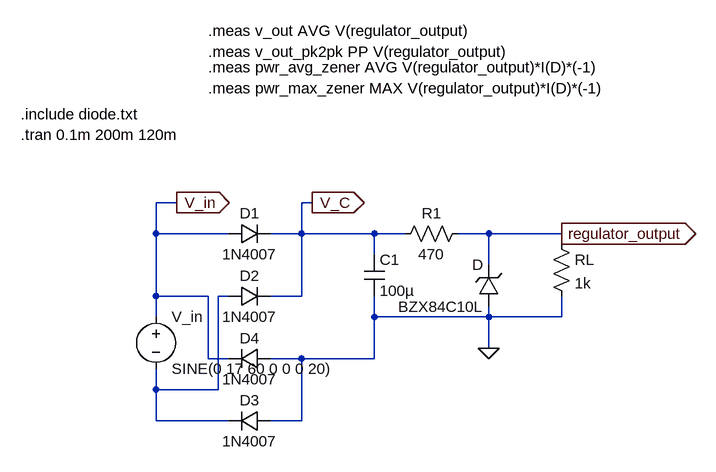
[diagram p0: schematic ECE2285_Project1.asc]
ECE2285_Project1.asc, the LTspice schematic file:
Version 4
SHEET 1 1112 680
WIRE 288 -80 256 -80
WIRE 496 -80 480 -80
WIRE 256 -32 256 -80
WIRE 368 -32 256 -32
WIRE 480 -32 480 -80
WIRE 480 -32 432 -32
WIRE 592 -32 480 -32
WIRE 640 -32 592 -32
WIRE 768 -32 720 -32
WIRE 880 -32 768 -32
WIRE 880 -16 880 -32
WIRE 592 0 592 -32
WIRE 768 16 768 -32
WIRE 256 64 256 -32
WIRE 336 64 256 64
WIRE 368 64 352 64
WIRE 480 64 480 -32
WIRE 480 64 432 64
WIRE 256 96 256 64
WIRE 592 96 592 64
WIRE 768 96 768 80
WIRE 768 96 592 96
WIRE 880 96 880 64
WIRE 880 96 768 96
WIRE 768 144 768 96
WIRE 336 160 336 64
WIRE 368 160 336 160
WIRE 480 160 432 160
WIRE 592 160 592 96
WIRE 592 160 480 160
WIRE 256 208 256 176
WIRE 352 208 352 64
WIRE 352 208 256 208
WIRE 256 256 256 208
WIRE 368 256 256 256
WIRE 480 256 480 160
WIRE 480 256 432 256
FLAG 768 144 0
FLAG 880 -32 regulator_output
IOPIN 880 -32 Out
FLAG 496 -80 V_C
IOPIN 496 -80 Out
FLAG 288 -80 V_in
IOPIN 288 -80 Out
SYMBOL voltage 256 80 R0
SYMATTR InstName V_in
SYMATTR Value SINE(0 17 60 0 0 0 20)
SYMBOL diode 368 -16 R270
WINDOW 0 32 32 VTop 2
WINDOW 3 0 32 VBottom 2
SYMATTR InstName D1
SYMATTR Value 1N4007
SYMBOL diode 368 80 R270
WINDOW 0 32 32 VTop 2
WINDOW 3 0 32 VBottom 2
SYMATTR InstName D2
SYMATTR Value 1N4007
SYMBOL diode 432 240 R90
WINDOW 0 0 32 VBottom 2
WINDOW 3 32 32 VTop 2
SYMATTR InstName D3
SYMATTR Value 1N4007
SYMBOL diode 432 144 R90
WINDOW 0 0 32 VBottom 2
WINDOW 3 32 32 VTop 2
SYMATTR InstName D4
SYMATTR Value 1N4007
SYMBOL cap 576 0 R0
SYMATTR InstName C1
SYMATTR Value 100µ
SYMBOL zener 784 80 R180
WINDOW 0 24 64 Left 2
WINDOW 3 24 0 Left 2
SYMATTR InstName D
SYMATTR Value BZX84C10L
SYMBOL res 736 -48 R90
WINDOW 0 0 56 VBottom 2
WINDOW 3 32 56 VTop 2
SYMATTR InstName R1
SYMATTR Value 470
SYMBOL res 864 -32 R0
SYMATTR InstName RL
SYMATTR Value 1k
TEXT 48 -216 Left 2 !.include diode.txt
TEXT 48 -184 Left 2 !.tran 0.1m 200m 120m
TEXT 336 -344 Left 2 !.meas v_out AVG V(regulator_output)
TEXT 336 -312 Left 2 !.meas v_out_pk2pk PP V(regulator_output)
TEXT 336 -288 Left 2 !.meas pwr_avg_zener AVG V(regulator_output)*I(D)*(-1)
TEXT 336 -256 Left 2 !.meas pwr_max_zener MAX V(regulator_output)*I(D)*(-1)

The netlist it stands for:
* ECE2285_Project1.asc
V_in V_in N001 SINE(0 17 60 0 0 0 20)
D1 V_in V_C 1N4007
D2 N001 V_C 1N4007
D3 0 N001 1N4007
D4 0 V_in 1N4007
C1 V_C 0 100µ
D 0 regulator_output BZX84C10L
R1 regulator_output V_C 470
RL regulator_output 0 1k
.model D D
.lib standard.dio
.include diode.txt
.tran 0.1m 200m 120m
.meas v_out AVG V(regulator_output)
.meas v_out_pk2pk PP V(regulator_output)
.meas pwr_avg_zener AVG V(regulator_output)*I(D)*(-1)
.meas pwr_max_zener MAX V(regulator_output)*I(D)*(-1)
.backanno
.end